# Altium schematic sheet Sheet1_PCI_mez.SchDoc
size A4 portrait; SheetNumber: 1; SheetTotal: 1
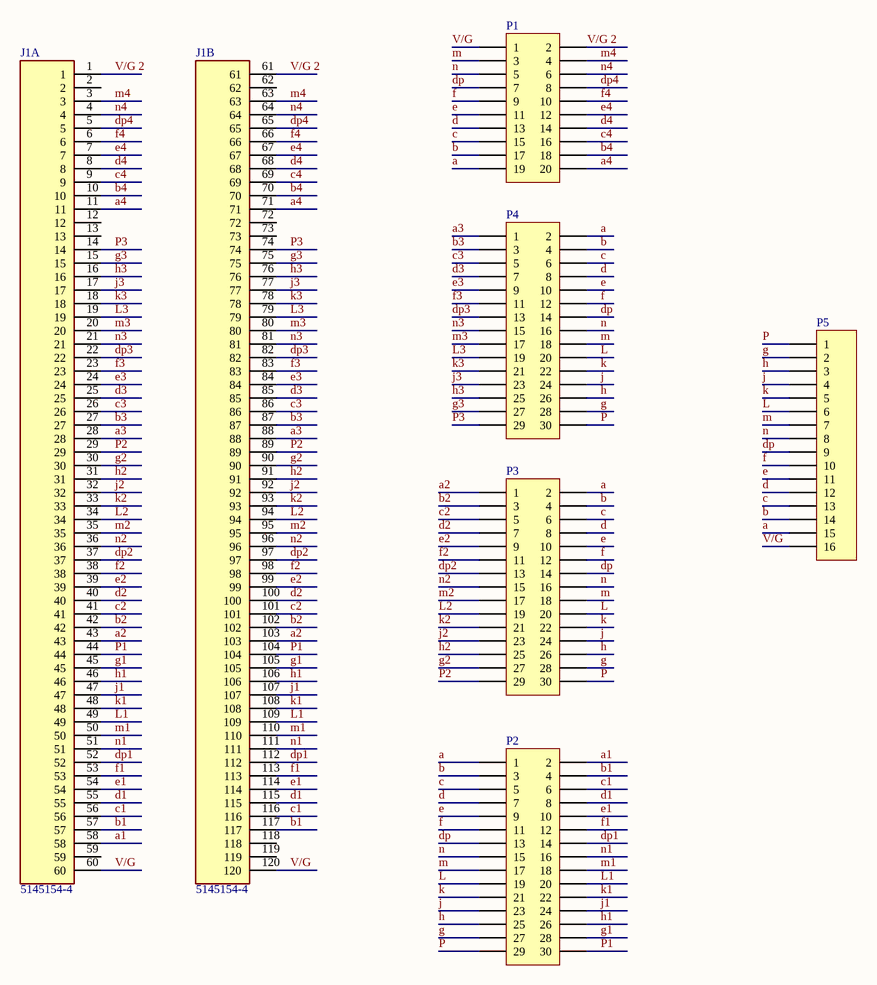
[diagram p0: Sheet1_PCI_mez.SchDoc]

## Parts
J1  5145154-4  [TE_5145154-4]  (parts A,B of 2)
P1  Header 10X2  [HDR2X10]  (value not drawn)
P2  Header 15X2  [HDR2X15]  (value not drawn)
P3  Header 15X2  [HDR2X15]  (value not drawn)
P4  Header 15X2  [HDR2X15]  (value not drawn)
P5  Header 16  [HDR1X16]  (value not drawn)

## Nets
a: P1.19 P2.1 P3.2 P4.2 P5.15
a1: J1.58 P2.2
a2: J1.43 J1.103 P3.1
a3: J1.28 J1.88 P4.1
a4: J1.11 J1.71 P1.20
b: P1.17 P2.3 P3.4 P4.4 P5.14
b1: J1.57 J1.117 P2.4
b2: J1.42 J1.102 P3.3
b3: J1.27 J1.87 P4.3
b4: J1.10 J1.70 P1.18
c: P1.15 P2.5 P3.6 P4.6 P5.13
c1: J1.56 J1.116 P2.6
c2: J1.41 J1.101 P3.5
c3: J1.26 J1.86 P4.5
c4: J1.9 J1.69 P1.16
d: P1.13 P2.7 P3.8 P4.8 P5.12
d1: J1.55 J1.115 P2.8
d2: J1.40 J1.100 P3.7
d3: J1.25 J1.85 P4.7
d4: J1.8 J1.68 P1.14
dp: P1.7 P2.13 P3.14 P4.14 P5.9
dp1: J1.52 J1.112 P2.14
dp2: J1.37 J1.97 P3.13
dp3: J1.22 J1.82 P4.13
dp4: J1.5 J1.65 P1.8
e: P1.11 P2.9 P3.10 P4.10 P5.11
e1: J1.54 J1.114 P2.10
e2: J1.39 J1.99 P3.9
e3: J1.24 J1.84 P4.9
e4: J1.7 J1.67 P1.12
f: P1.9 P2.11 P3.12 P4.12 P5.10
f1: J1.53 J1.113 P2.12
f2: J1.38 J1.98 P3.11
f3: J1.23 J1.83 P4.11
f4: J1.6 J1.66 P1.10
g: P2.27 P3.28 P4.28 P5.2
g1: J1.45 J1.105 P2.28
g2: J1.30 J1.90 P3.27
g3: J1.15 J1.75 P4.27
h: P2.25 P3.26 P4.26 P5.3
h1: J1.46 J1.106 P2.26
h2: J1.31 J1.91 P3.25
h3: J1.16 J1.76 P4.25
j: P2.23 P3.24 P4.24 P5.4
j1: J1.47 J1.107 P2.24
j2: J1.32 J1.92 P3.23
j3: J1.17 J1.77 P4.23
k: P2.21 P3.22 P4.22 P5.5
k1: J1.48 J1.108 P2.22
k2: J1.33 J1.93 P3.21
k3: J1.18 J1.78 P4.21
L: P2.19 P3.20 P4.20 P5.6
L1: J1.49 J1.109 P2.20
L2: J1.34 J1.94 P3.19
L3: J1.19 J1.79 P4.19
m: P1.3 P2.17 P3.18 P4.18 P5.7
m1: J1.50 J1.110 P2.18
m2: J1.35 J1.95 P3.17
m3: J1.20 J1.80 P4.17
m4: J1.3 J1.63 P1.4
n: P1.5 P2.15 P3.16 P4.16 P5.8
n1: J1.51 J1.111 P2.16
n2: J1.36 J1.96 P3.15
n3: J1.21 J1.81 P4.15
n4: J1.4 J1.64 P1.6
P: P2.29 P3.30 P4.30 P5.1
P1: J1.44 J1.104 P2.30
P2: J1.29 J1.89 P3.29
P3: J1.14 J1.74 P4.29
V/G: J1.60 J1.120 P1.1 P5.16
V/G 2: J1.1 J1.61 P1.2

Not connected (* = marked no-connect by the designer): J1 2 12 13 59 62 72 73 118 119

## Library data of the parts
J1 = 5145154-4: Conn, Card Edge, Thermoplastic, White, 60 Dual Pos., Gold Cont., PCI | TE Connectivity 5145154-4; Product_Type: Connector; Number_of_Positions: 120; Centerline_Pitch: 1.27 mm[.05 in]; SnapEDA_Link: https://www.snapeda.com/parts/5145154-4/TE+Connectivity+AMP+Connectors/view-part/?ref=snap; Package: None; Value: *; MF: TE Connectivity; MP: 5145154-4; EU_RoHS_Compliance: Compliant; Check_prices: https://www.snapeda.com/parts/5145154-4/TE+Connectivity+AMP+Connectors/view-part/?ref=eda
P1 = Header 10X2: Header, 10-Pin, Dual row; LatestRevisionDate: 17-Jul-2002; LatestRevisionNote: Re-released for DXP Platform.; Publisher: Altium Limited
P2-P4 = Header 15X2: Header, 15-Pin, Dual row; LatestRevisionDate: 17-Jul-2002; LatestRevisionNote: Re-released for DXP Platform.; Publisher: Altium Limited
P5 = Header 16: Header, 16-Pin; LatestRevisionDate: 17-Jul-2002; LatestRevisionNote: Re-released for DXP Platform.; Publisher: Altium Limited